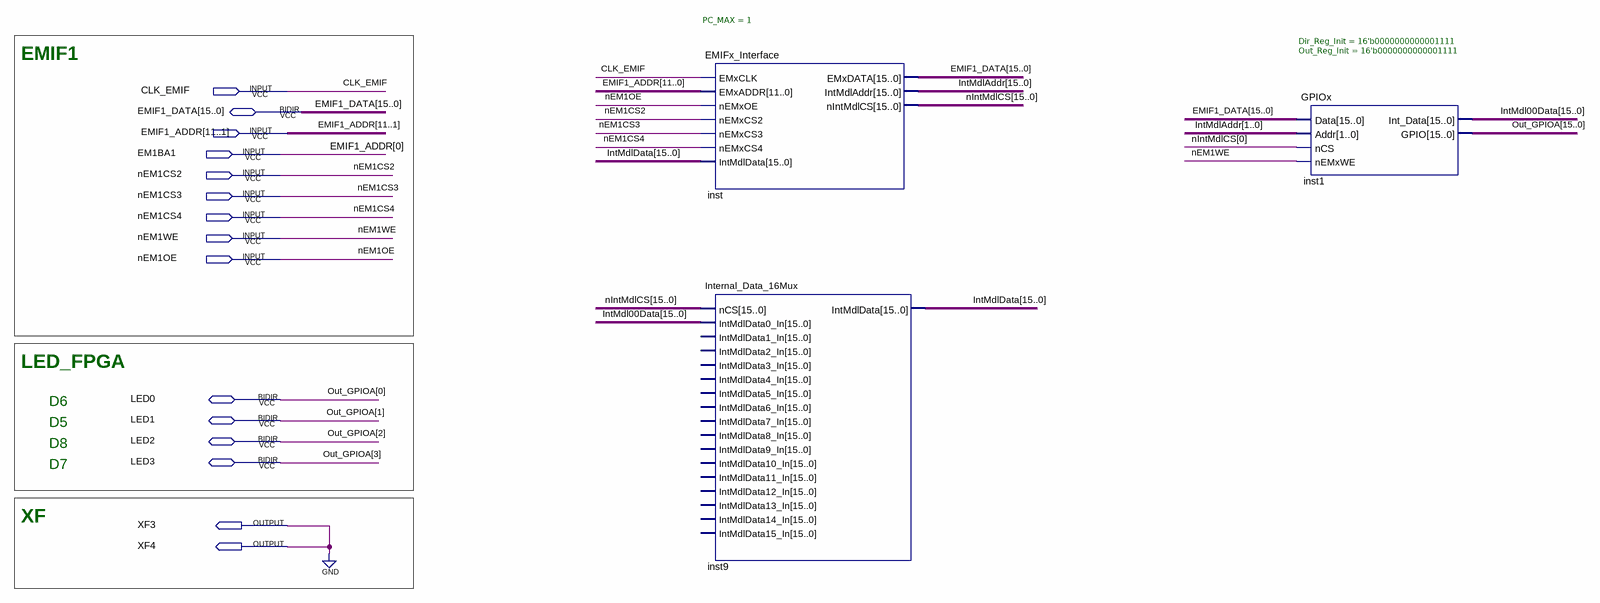
[diagram p0: schematic sheet]
// Quartus schematic MMC31_Slave_R2.bdf as structural Verilog: 3 symbols, 15 pins
module MMC31_Slave_R2 (
  input  CLK_EMIF,
  input  [11:1] EMIF1_ADDR,
  input  EM1BA1,
  input  nEM1CS2,
  input  nEM1CS3,
  input  nEM1CS4,
  input  nEM1WE,
  input  nEM1OE,
  inout  [15:0] EMIF1_DATA,
  inout  LED0,
  inout  LED1,
  inout  LED2,
  inout  LED3,
  output XF3,
  output XF4
);

  wire [15:0] IntMdl00Data, IntMdlAddr, IntMdlData, nIntMdlCS;
  wire [15:4] Out_GPIOA;

  EMIFx_Interface #(.PC_MAX(1)) inst (
    .EMxCLK(CLK_EMIF), .EMxADDR({EMIF1_ADDR, EM1BA1}), .nEMxOE(nEM1OE), .nEMxCS2(nEM1CS2), .nEMxCS3(nEM1CS3),
    .nEMxCS4(nEM1CS4), .IntMdlData(IntMdlData), .IntMdlAddr(IntMdlAddr), .nIntMdlCS(nIntMdlCS),
    .EMxDATA(EMIF1_DATA));
  Internal_Data_16Mux inst9 (
    .nCS(nIntMdlCS), .IntMdlData0_In(IntMdl00Data), .IntMdlData(IntMdlData));  // open: IntMdlData1_In, IntMdlData2_In, IntMdlData3_In, IntMdlData4_In, IntMdlData5_In, IntMdlData6_In, IntMdlData7_In, IntMdlData8_In, IntMdlData9_In, IntMdlData10_In, IntMdlData11_In, IntMdlData12_In, IntMdlData13_In, IntMdlData14_In, IntMdlData15_In
  GPIOx #(.Dir_Reg_Init(16'b0000000000001111), .Out_Reg_Init(16'b0000000000001111)) inst1 (
    .Data(EMIF1_DATA), .Addr(IntMdlAddr[1:0]), .nCS(nIntMdlCS[0]), .nEMxWE(nEM1WE), .Int_Data(IntMdl00Data),
    .GPIO({Out_GPIOA, LED3, LED2, LED1, LED0}));

  assign XF3 = 1'b0;
  assign XF4 = 1'b0;

  // Other names for the same wires on the sheet: EMIF1_ADDR[0] = EM1BA1; Out_GPIOA[3:0] = {LED3, LED2, LED1, LED0}

  // Notes on the sheet:
  //   EMIF1
  //   LED_FPGA
  //   D6
  //   D5
  //   D8
  //   D7
  //   XF
endmodule
